# EAGLE design pheonix (EAGLE 9.4.2)
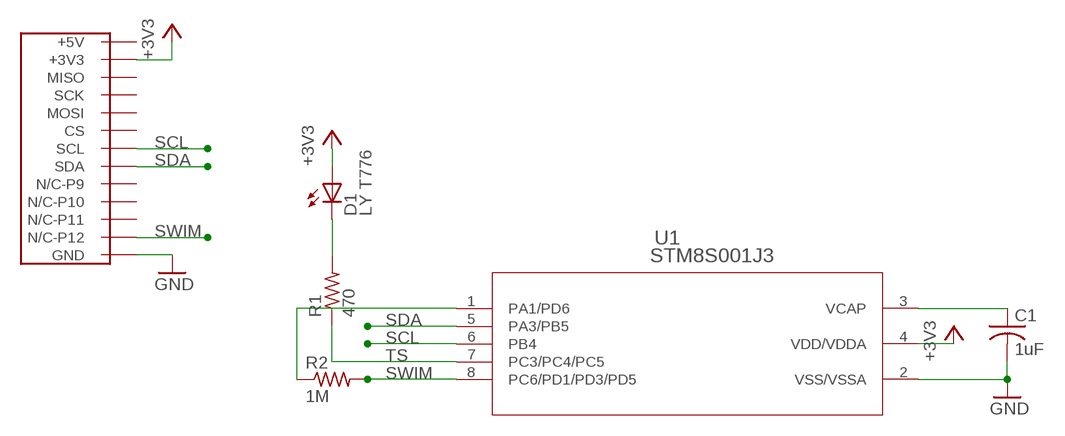
[diagram p0: schematic, sheet 1]

## Parts
C1  1uF  C-USC1206  [C1206]
D1  LY T776  LEDBACK_SMALL  [P-LCC-2-TOPLED-RG-SMALL]
R1  470  R-US_M1206  [M1206]
R2  1M  R-US_M1206  [M1206]
U1  STM8S001J3  [SOD8N_4P9X6]
U$1  BADGE64FOOTPRINT  [BADGE64-FOOTPRINT]

## Nets
+3V3: D1.A U1.4(VDD/VDDA) U$1.+3V3-P7(+3V3) U$1.+3V3-P15(+3V3)
GND: C1.2 U1.2(VSS/VSSA) U$1.GND-P2(GND) U$1.GND-P8(GND) U$1.GND-P16(GND)
N$1: D1.C R1.2
N$2: R1.1 U1.7(PC3/PC4/PC5)
N$3: C1.1 U1.3(VCAP)
SCL: U1.6(PB4) U$1.SCL
SDA: U1.5(PA3/PB5) U$1.SDA
SWIM: R2.2 U1.8(PC6/PD1/PD3/PD5) U$1.NC-P12(N/C-P12)
TS: R2.1 U1.1(PA1/PD6)
Unconnected: U$1.CS U$1.MISO U$1.MOSI U$1.NC-P9(N/C-P9) U$1.NC-P10(N/C-P10) U$1.NC-P11(N/C-P11) U$1.SCK

## Power pins joined to a net without a drawn wire
+5V: U$1.+5V

## Library data of the parts
C1 = resistor:C-US: CAPACITOR, American symbol
D1 = grange:LED: LED OSRAM: - CHIPLED LG R971, LG N971, LY N971, LG Q971, LY Q971, LO R971, LY R971 LH N974, LH R974 LS Q976, LO Q976, LY Q976 LO Q996 - Hyper CHIPLED LW Q18S LB Q993, LB Q99A, LB R99A - SideLED LS A670, LO A670, LY A670, LG A670, LP A670 LB A673, LV A673, LT A673, LW A673 LH A674 LY A675 LS A676, LA A676, LO A676, LY A676, LW A676 LS A679, LY A679, LG A679 - Hyper Micro SIDELED® LS Y876, LA Y876, LO Y876, LY Y876 LT Y87S - SmartLED LW L88C, LW L88S LB L89C, LB L89S, LG L890 LS L89K, LO L89K, LY L89K LS L896, LA L896, LO L896, LY L896 - TOPLED LS T670, LO T670, LY T670, LG T670, LP T670 LSG T670, LSP T670, LSY T670, LOP T670, LYG T670 LG T671, LOG T671, LSG T671 LB T673, LV T673, LT T673, LW T673 LH T674 LS T676, LA T676, LO T676, LY T676, LB T676, LH T676, LSB T676, LW T676 LB T67C, LV T67C, LT T67C, LS T67K, LO T67K, LY T67K, LW E67C LS E67B, LA E67B, LO E67B, LY E67B, LB E67C, LV E67C, LT E67C LW T67C LS T679, LY T679, LG T679 LS T770, LO T770, LY T770, LG T770, LP T770 LB T773, LV T773, LT T773, LW T773 LH T774 LS E675, LA E675, LY E675, LS T675 LS T776, LA T776, LO T776, LY T776, LB T776 LHGB T686 LT T68C, LB T68C - Hyper Mini TOPLED® LB M676 - Mini TOPLED Santana® LG M470 LS M47K, LO M47K, LY M47K Source: http://www.osram.convergy.de/
R1 R2 = resistor:R-US_: RESISTOR, American symbol
U1 = grange:STM8S001J3; MANUFACTURER_PART_NUMBER: STM8S001J3; VENDOR: STMicroelectronics
U$1 = MiniBadge:BADGE64

## Board
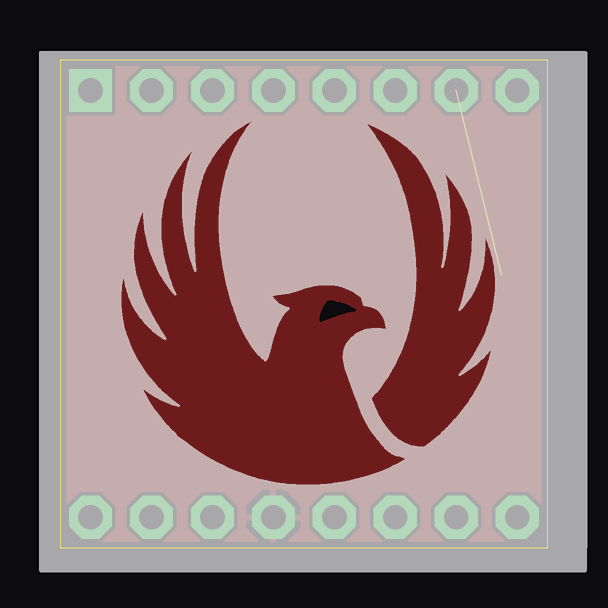
[diagram p1: board, top side]
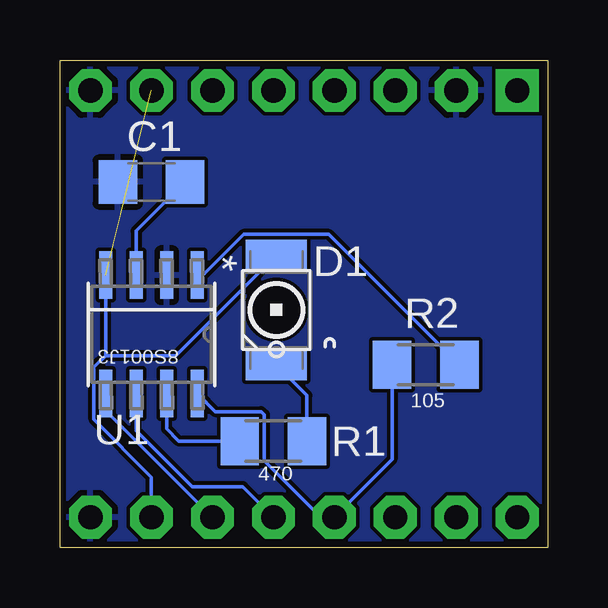
[diagram p2: board, bottom side, seen from below]

Size 20.32 x 20.32 mm. Coordinates in mm from the lower left corner, seen from the top.
Outline: 0,0 20.32,0 20.32,20.32 0,20.32 0,0
Copper layers (1*16): Top 0.035mm / dielectric 1.5mm / Bottom 0.035mm
Design rules "default *": minimum track width 6mil, minimum drill 0.35mm, track to track 6mil, track to pad 6mil, pad to pad 6mil, via to via 6mil, smd to smd 6mil, copper to edge 10mil, drill to drill 6mil, minimum pad ring 10mil, minimum via ring 8mil, stop-mask expansion 4mil, vias tented up to drill 0mil, thermal gap 10mil
tRestrict: area 10.9,9.5 to 12.3,10.3

### Footprints (pad centres in the part's own frame; a part is rotated, then mirrored left to right if it is on the bottom)
C1206 = smd 1.6 x 1.8: 1 -1.4,0; 2 1.4,0
P-LCC-2-TOPLED-RG-SMALL = smd 2.54 x 1.27: A 0,2.286; C 0,-2.286
M1206 = smd 1.6 x 2: 1 -1.4,0; 2 1.4,0
SOD8N_4P9X6 = smd 1.981 x 0.533: 1 -2.464,1.905; 2 -2.464,0.635; 3 -2.464,-0.635; 4 -2.464,-1.905; 5 2.464,-1.905; 6 2.464,-0.635; 7 2.464,0.635; 8 2.464,1.905
BADGE64-FOOTPRINT = drill 1.016 pad 1.778 octagon: +3V3-P7 15.24,0; +3V3-P15 15.24,-17.78; CS 12.7,0; GND-P2 2.54,0; GND-P8 17.78,0; GND-P16 17.78,-17.78; MISO 5.08,0; MOSI 10.16,0; NC-P9 0,-17.78; NC-P10 2.54,-17.78; NC-P11 5.08,-17.78; NC-P12 7.62,-17.78; SCK 7.62,0; SCL 10.16,-17.78; SDA 12.7,-17.78 | drill 1.016 pad 1.778 square: +5V 0,0

### Placement (x,y rotation side)
C1  16.51,15.24 180 bottom
D1  11.3,9.91 0 bottom
R1  11.43,4.45 0 bottom
R2  5.08,7.62 180 bottom
U1  16.51,8.89 270 bottom
U$1  1.27,19.05 0 top

### Tracks (layer width: path | path; a pad name or v marks a point on that pad's centre or on a via)
+3V3  (1 unrouted)
  Bottom 0.152: U$1.+3V3-P15 16.51,2.94 18.91,5.34 18.91,7.51 18.41,8.01 | 18.41,8.01 U1.4 | D1.A 15.49,8.01 18.41,8.01
GND
  pour Bottom (rank 6): -1.27,-1.27 -1.27,21.59 21.59,21.59 21.59,-1.27
N$1
  Bottom 0.152: R1.2 10.03,6.35 D1.C
N$2
  Bottom 0.152: R1.1 15.37,4.45 15.88,4.95 U1.7
N$3
  Bottom 0.152: C1.1 17.14,13.21 U1.3
SCL
  Bottom 0.152: U$1.SCL 12.7,2.54 14.81,2.54 17.14,4.88 U1.6
SDA
  Bottom 0.152: U$1.SDA 18.41,5.71 U1.5
SWIM
  Bottom 0.152: U1.8 13.85,5.67 11.94,5.67 11.8,5.54 11.8,3.62 9.45,1.27 U$1.NC-P12 6.48,3.68 R2.2
  pour Top (rank 3): 0,20.32 0,0 20.32,0 20.32,20.32
TS
  Bottom 0.152: U1.1 14.37,11.35 12.67,13.06 9.12,13.06 R2.1

### Text on the board
bPlace: 8S001J3 | 105 | 470